# Altium schematic sheet 1s电池接收电路_2023-08-15.schdoc
size 233 x 158 mm
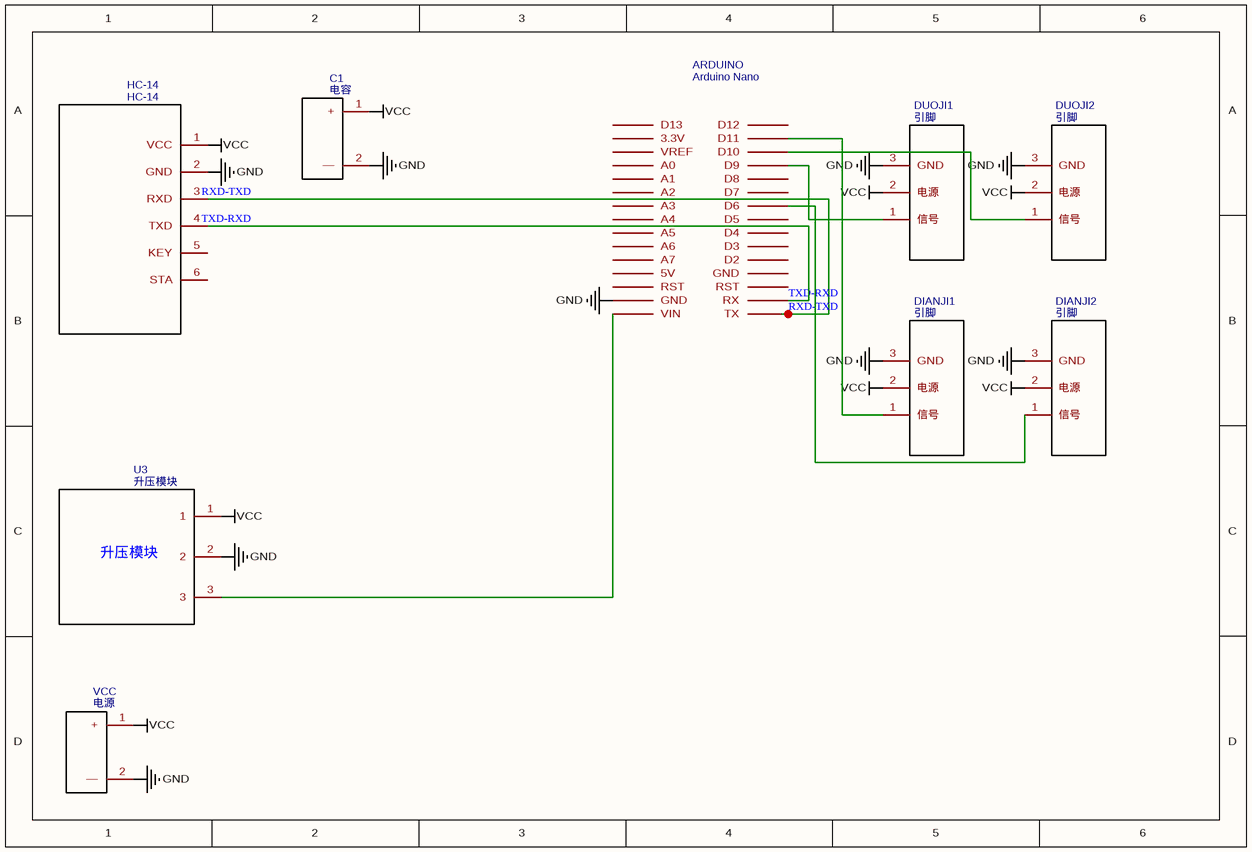
[diagram p0: 1s电池接收电路_2023-08-15.schdoc]

## Parts
ARDUINO  Arduino Nano  [ARDUINO NANO]
C1  电容  [电容]
DIANJI1  引脚  [引脚]
DIANJI2  引脚  [引脚]
DUOJI1  引脚  [引脚]
DUOJI2  引脚  [引脚]
HC-14  HC-14  [HC-14]
U3  升压模块  [升压模块]
VCC  电源  [电容]

## Nets
GND: ARDUINO.29(GND) C1.2(—) DIANJI1.3(GND) DIANJI2.3(GND) DUOJI1.3(GND) DUOJI2.3(GND) HC-14.2(GND) U3.2 VCC.2(—)
VCC: C1.1(+) DIANJI1.2(电源) DIANJI2.2(电源) DUOJI1.2(电源) DUOJI2.2(电源) HC-14.1(VCC) U3.1 VCC.1(+)
RXD-TXD: ARDUINO.1(TX) HC-14.3(RXD)
TXD-RXD: ARDUINO.2(RX) HC-14.4(TXD)
NetARDUINO_9: ARDUINO.9(D6) DIANJI2.1(信号)
NetARDUINO_12: ARDUINO.12(D9) DUOJI1.1(信号)
NetARDUINO_13: ARDUINO.13(D10) DUOJI2.1(信号)
NetARDUINO_14: ARDUINO.14(D11) DIANJI1.1(信号)
NetARDUINO_30: ARDUINO.30(VIN) U3.3

Not connected (* = marked no-connect by the designer): ARDUINO 3(RST) 4(GND) 5(D2) 6(D3) 7(D4) 8(D5) 10(D7) 11(D8) 15(D12) 16(D13) 17(3.3V) 18(VREF) 19(A0) 20(A1) 21(A2) 22(A3) 23(A4) 24(A5) 25(A6) 26(A7) 27(5V) 28(RST); HC-14 5(KEY) 6(STA)

## Notes on the sheet
- Labels drawn without touching a wire or pin: RXD-TXD, TXD-RXD

## Library data of the parts
ARDUINO = Arduino Nano: Contributor: jacobadam; spicePre: U; spiceSymbolName: Arduino Nano
C1 = 电容: Contributor: jacobadam; spicePre: U; spiceSymbolName: 电容
DIANJI1 DIANJI2 DUOJI1 DUOJI2 = 引脚: Contributor: jacobadam; spicePre: U; spiceSymbolName: 引脚
HC-14 = HC-14: Contributor: jacobadam; spicePre: U; spiceSymbolName: HC-14
U3 = 升压模块: Contributor: jacobadam; spicePre: U; spiceSymbolName: 升压模块
VCC = 电源: Contributor: jacobadam; spicePre: U; spiceSymbolName: 电容